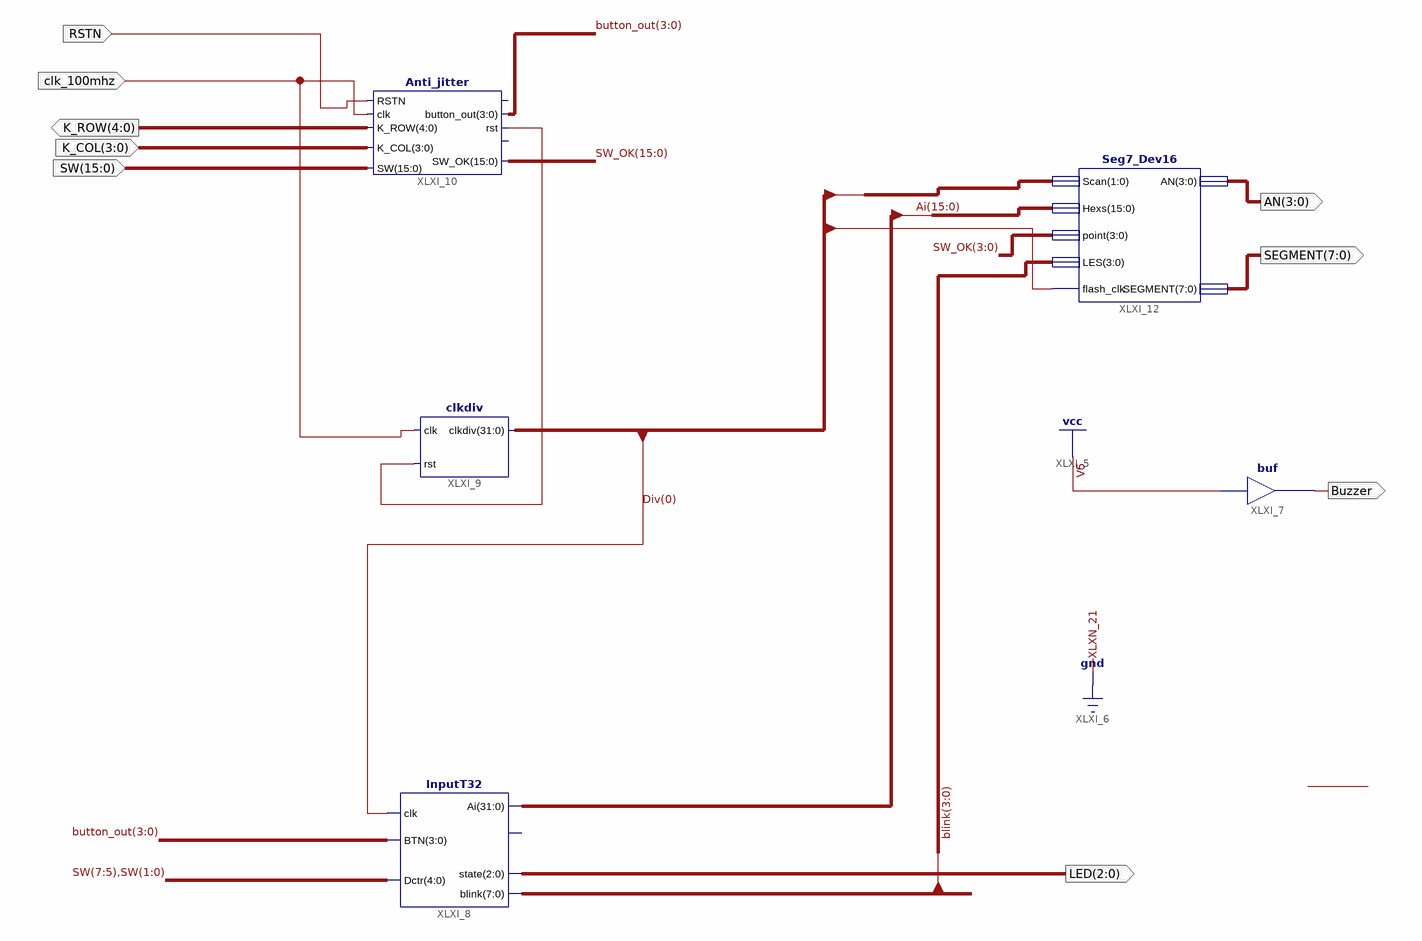
[diagram p0: schematic sheet 1]
// Xilinx ISE schematic Show.sch (kintex7) as structural Verilog: 5 symbols, 9 ports
module Show (
  input  clk_100mhz,
  input  RSTN,
  input  [15:0] SW,
  input  [3:0] K_COL,
  output Buzzer,
  output [4:0] K_ROW,
  output [2:0] LED,
  output [7:0] SEGMENT,
  output [3:0] AN
);

  wire XLXN_35;
  wire [3:0] button_out;
  wire [7:0] blink;
  wire [15:0] SW_OK;
  wire [31:0] Ai, Div;

  buf XLXI_7 (Buzzer, 1'b1);
  InputT32 XLXI_8 (
    .clk(Div[0]), .BTN(button_out), .Dctr({SW[7:5], SW[1:0]}), .blink(blink), .state(LED), .Ai(Ai));  // open: Bi
  clkdiv XLXI_9 (.rst(XLXN_35), .clkdiv(Div), .clk(clk_100mhz));
  Anti_jitter XLXI_10 (
    .SW_OK(SW_OK), .SW(SW), .K_COL(K_COL), .K_ROW(K_ROW), .clk(clk_100mhz), .RSTN(RSTN), .rst(XLXN_35),
    .button_out(button_out));  // open: button_pulse, CR
  Seg7_Dev16 XLXI_12 (
    .Scan(Div[18:17]), .Hexs(Ai[15:0]), .point(SW_OK[3:0]), .LES(blink[3:0]), .flash_clk(Div[25]), .AN(AN),
    .SEGMENT(SEGMENT));
endmodule
